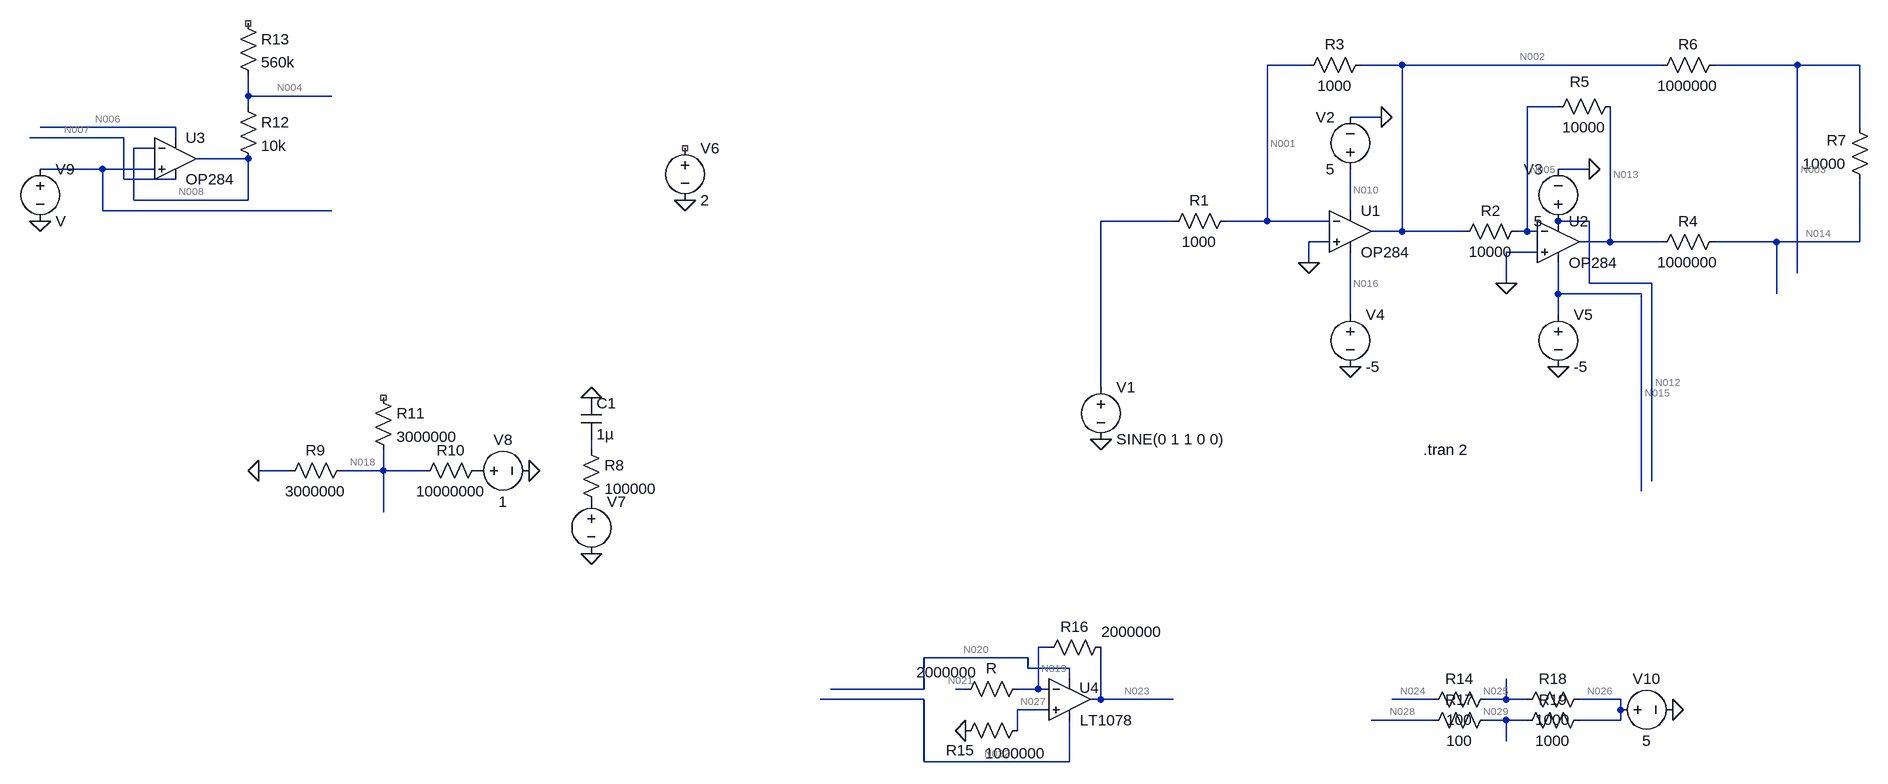
[diagram p0: schematic Sim_negADCinversion_9_18_20.asc]
Sim_negADCinversion_9_18_20.asc, the LTspice schematic file:
Version 4
SHEET 1 2288 884
WIRE 432 -192 368 -192
WIRE 576 -192 512 -192
WIRE 976 -192 576 -192
WIRE 1184 -192 1056 -192
WIRE 1280 -192 1184 -192
WIRE -1200 -144 -1200 -176
WIRE -1072 -144 -1200 -144
WIRE -1200 -128 -1200 -144
WIRE 816 -128 768 -128
WIRE 544 -112 496 -112
WIRE -1312 -96 -1520 -96
WIRE 1280 -96 1280 -192
WIRE -1392 -80 -1536 -80
WIRE -1312 -80 -1312 -96
WIRE -1344 -64 -1376 -64
WIRE -1200 -48 -1280 -48
WIRE -1424 -32 -1520 -32
WIRE -1344 -32 -1424 -32
WIRE 864 -32 816 -32
WIRE -1392 -16 -1392 -80
WIRE -1312 -16 -1392 -16
WIRE -1376 16 -1376 -64
WIRE -1200 16 -1200 -48
WIRE -1200 16 -1376 16
WIRE -1424 32 -1424 -32
WIRE -1072 32 -1424 32
WIRE 496 32 496 -32
WIRE 224 48 112 48
WIRE 368 48 368 -192
WIRE 368 48 304 48
WIRE 464 48 368 48
WIRE 864 48 816 48
WIRE 576 64 576 -192
WIRE 576 64 528 64
WIRE 672 64 576 64
WIRE 768 64 768 -128
WIRE 768 64 752 64
WIRE 784 64 768 64
WIRE 464 80 432 80
WIRE 896 80 896 -128
WIRE 896 80 848 80
WIRE 976 80 896 80
WIRE 1152 80 1056 80
WIRE 1280 80 1280 -16
WIRE 1280 80 1152 80
WIRE 784 96 736 96
WIRE 432 112 432 80
WIRE 1184 128 1184 -192
WIRE 736 144 736 96
WIRE 864 144 864 48
WIRE 960 144 864 144
WIRE 816 160 816 112
WIRE 944 160 816 160
WIRE 1152 160 1152 80
WIRE 496 192 496 96
WIRE 816 192 816 160
WIRE 112 304 112 48
WIRE -672 400 -672 384
WIRE -1136 432 -1184 432
WIRE -992 432 -992 400
WIRE -992 432 -1056 432
WIRE -928 432 -992 432
WIRE 960 448 960 144
WIRE 944 464 944 160
WIRE -992 496 -992 432
WIRE 32 704 16 704
WIRE 0 720 -160 720
WIRE 0 736 0 720
WIRE 64 736 0 736
WIRE 64 752 64 736
WIRE -160 768 -160 720
WIRE -160 768 -304 768
WIRE -96 768 -112 768
WIRE 16 768 16 704
WIRE 16 768 -16 768
WIRE 32 768 16 768
WIRE -160 784 -320 784
WIRE 112 784 112 704
WIRE 112 784 96 784
WIRE 224 784 112 784
WIRE 624 784 560 784
WIRE 736 784 736 752
WIRE 736 784 704 784
WIRE 768 784 736 784
WIRE 912 784 848 784
WIRE 32 800 -16 800
WIRE 912 800 912 784
WIRE 624 816 528 816
WIRE 736 816 704 816
WIRE 768 816 736 816
WIRE 912 816 912 800
WIRE 912 816 848 816
WIRE -16 832 -16 800
WIRE 736 848 736 816
WIRE -160 880 -160 784
WIRE 64 880 64 816
WIRE 64 880 -160 880
FLAG 432 112 0
FLAG 736 144 0
FLAG 112 384 0
FLAG 496 272 0
FLAG 816 272 0
FLAG 864 -32 0
FLAG 544 -112 0
FLAG -528 16 0
FLAG -672 560 0
FLAG -672 320 0
FLAG -768 432 0
FLAG -1184 432 0
FLAG -1520 48 0
FLAG -96 832 0
FLAG 992 800 0
SYMBOL voltage 112 288 R0
WINDOW 123 0 0 Left 0
WINDOW 39 0 0 Left 0
SYMATTR InstName V1
SYMATTR Value SINE(0 1 1 0 0)
SYMBOL res 320 32 R90
WINDOW 0 0 56 VBottom 2
WINDOW 3 32 56 VTop 2
SYMATTR InstName R1
SYMATTR Value 1000
SYMBOL Opamps\\OP284 496 0 R0
SYMATTR InstName U1
SYMBOL Opamps\\OP284 816 16 R0
SYMATTR InstName U2
SYMBOL res 768 48 R90
WINDOW 0 0 56 VBottom 2
WINDOW 3 32 56 VTop 2
SYMATTR InstName R2
SYMATTR Value 10000
SYMBOL res 528 -208 R90
WINDOW 0 0 56 VBottom 2
WINDOW 3 32 56 VTop 2
SYMATTR InstName R3
SYMATTR Value 1000
SYMBOL res 912 -144 R90
WINDOW 0 -7 63 VBottom 2
WINDOW 3 32 56 VTop 2
SYMATTR InstName R5
SYMATTR Value 10000
SYMBOL voltage 496 -16 R180
WINDOW 0 24 96 Left 2
WINDOW 3 24 16 Left 2
WINDOW 123 0 0 Left 0
WINDOW 39 0 0 Left 0
SYMATTR InstName V2
SYMATTR Value 5
SYMBOL voltage 816 64 R180
WINDOW 0 24 96 Left 2
WINDOW 3 24 16 Left 2
WINDOW 123 0 0 Left 0
WINDOW 39 0 0 Left 0
SYMATTR InstName V3
SYMATTR Value 5
SYMBOL res 1072 -208 R90
WINDOW 0 0 56 VBottom 2
WINDOW 3 32 56 VTop 2
SYMATTR InstName R6
SYMATTR Value 1000000
SYMBOL res 1296 0 R180
WINDOW 0 36 76 Left 2
WINDOW 3 36 40 Left 2
SYMATTR InstName R7
SYMATTR Value 10000
SYMBOL res 1072 64 R90
WINDOW 0 0 56 VBottom 2
WINDOW 3 32 56 VTop 2
SYMATTR InstName R4
SYMATTR Value 1000000
SYMBOL voltage 496 176 R0
WINDOW 123 0 0 Left 0
WINDOW 39 0 0 Left 0
SYMATTR InstName V4
SYMATTR Value -5
SYMBOL voltage 816 176 R0
WINDOW 123 0 0 Left 0
WINDOW 39 0 0 Left 0
SYMATTR InstName V5
SYMATTR Value -5
SYMBOL voltage -528 -80 R0
WINDOW 123 0 0 Left 0
WINDOW 39 0 0 Left 0
SYMATTR InstName V6
SYMATTR Value 2
SYMBOL voltage -672 464 R0
WINDOW 123 0 0 Left 0
WINDOW 39 0 0 Left 0
SYMATTR InstName V7
SYMATTR Value ""
SYMBOL res -688 384 R0
SYMATTR InstName R8
SYMATTR Value 100000
SYMBOL cap -688 320 R0
SYMATTR InstName C1
SYMATTR Value 1µ
SYMBOL res -1040 416 R90
WINDOW 0 0 56 VBottom 2
WINDOW 3 32 56 VTop 2
SYMATTR InstName R9
SYMATTR Value 3000000
SYMBOL res -832 416 R90
WINDOW 0 0 56 VBottom 2
WINDOW 3 32 56 VTop 2
SYMATTR InstName R10
SYMATTR Value 10000000
SYMBOL voltage -864 432 R270
WINDOW 0 32 56 VTop 2
WINDOW 3 -32 56 VBottom 2
WINDOW 123 0 0 Left 0
WINDOW 39 0 0 Left 0
SYMATTR InstName V8
SYMATTR Value 1
SYMBOL res -1008 304 R0
SYMATTR InstName R11
SYMATTR Value 3000000
SYMBOL voltage -1520 -48 R0
SYMATTR InstName V9
SYMBOL Opamps\\OP284 -1312 -112 R0
SYMATTR InstName U3
SYMBOL res -1216 -144 R0
SYMATTR InstName R12
SYMATTR Value 10k
SYMBOL res -1216 -272 R0
SYMATTR InstName R13
SYMATTR Value 560k
SYMBOL Opamps\\LT1078 64 720 R0
WINDOW 0 15 46 Left 2
SYMATTR InstName U4
SYMBOL res 0 752 R90
WINDOW 0 0 56 VBottom 2
WINDOW 3 -25 124 VTop 2
SYMATTR InstName R
SYMATTR Value 2000000
SYMBOL res 0 816 R90
WINDOW 0 62 104 VBottom 2
WINDOW 3 35 19 VTop 2
SYMATTR InstName R15
SYMATTR Value 1000000
SYMBOL res 128 688 R90
WINDOW 0 0 56 VBottom 2
WINDOW 3 -24 -32 VTop 2
SYMATTR InstName R16
SYMATTR Value 2000000
SYMBOL res 720 768 R90
WINDOW 0 0 56 VBottom 2
WINDOW 3 32 56 VTop 2
SYMATTR InstName R14
SYMATTR Value 100
SYMBOL res 720 800 R90
WINDOW 0 0 56 VBottom 2
WINDOW 3 32 56 VTop 2
SYMATTR InstName R17
SYMATTR Value 100
SYMBOL res 864 768 R90
WINDOW 0 0 56 VBottom 2
WINDOW 3 32 56 VTop 2
SYMATTR InstName R18
SYMATTR Value 1000
SYMBOL res 864 800 R90
WINDOW 0 0 56 VBottom 2
WINDOW 3 32 56 VTop 2
SYMATTR InstName R19
SYMATTR Value 1000
SYMBOL voltage 896 800 R270
WINDOW 0 32 56 VTop 2
WINDOW 3 -32 56 VBottom 2
WINDOW 123 0 0 Left 0
WINDOW 39 0 0 Left 0
SYMATTR InstName V10
SYMATTR Value 5
TEXT 608 400 Left 2 !.tran 2

The netlist it stands for:
* Sim_negADCinversion_9_18_20.asc
V1 N011 0 SINE(0 1 1 0 0)
R1 N001 N011 1000
XU1 0 N001 N010 N016 N002 OP284  ; pins In+ In- V+ V- OUT
XU2 0 N005 N012 N015 N013 OP284  ; pins In+ In- V+ V- OUT
R2 N005 N002 10000
R3 N002 N001 1000
R5 N013 N005 10000
V2 N010 0 5
V3 N012 0 5
R6 N003 N002 1000000
R7 N014 N003 10000
R4 N014 N013 1000000
V4 N016 0 -5
V5 N015 0 -5
V6 NC_01 0 2
V7 P001 0
R8 N017 P001 100000
C1 0 N017 1µ
R9 N018 0 3000000
R10 P002 N018 10000000
V8 P002 0 1
R11 NC_02 N018 3000000
V9 N009 0 V
XU3 N009 N008 N006 N007 N008 OP284  ; pins In+ In- V+ V- OUT
R12 N004 N008 10k
R13 NC_03 N004 560k
XU4 N027 N019 N020 N022 N023 LT1078  ; pins In+ In- V+ V- OUT
R N019 N021 2000000
R15 N027 0 1000000
R16 N023 N019 2000000
R14 N025 N024 100
R17 N029 N028 100
R18 N026 N025 1000
R19 N026 N029 1000
V10 N026 0 5
.tran 2
.lib ADI1.lib
.backanno
.end

* Results of the author's LTspice run, read from the files saved beside the schematic
* Operating Point, zero values left out:
*   V(n001) = 21.9 µV
*   V(n010) = 5 V
*   V(n016) = -5 V
*   V(n002) = -13.43 µV
*   V(n005) = 21.9 µV
*   V(n012) = 5 V
*   V(n015) = -5 V
*   V(n013) = -515.2 µV
*   V(n003) = -263.1 µV
*   V(n014) = -265.5 µV
*   V(n018) = 230.8 mV
*   V(p002) = 1 V
*   V(n008) = -65.28 µV
*   V(n006) = -628.8 mV
*   V(n007) = 628.7 mV
*   V(n004) = -65.28 µV
*   V(n019) = 18.28 V
*   V(n027) = 28.85 mV
*   V(n020) = 18.84 V
*   V(n023) = 18.33 V
*   V(n022) = 18.33 V
*   V(n021) = 18.28 V
*   V(n025) = 5 V
*   V(n024) = 5 V
*   V(n029) = 5 V
*   V(n028) = 5 V
*   V(n026) = 5 V
*   I(R16) = 21.27 nA
*   I(R15) = 28.85 nA
*   I(R10) = 76.92 nA
*   I(R9) = 76.92 nA
*   I(R4) = 249.6 pA
*   I(R7) = -249.6 pA
*   I(R6) = -249.6 pA
*   I(R5) = -53.71 nA
*   I(R3) = -35.34 nA
*   I(R2) = 3.534 nA
*   I(R1) = 21.9 nA
*   I(V8) = -76.92 nA
*   I(V5) = 1.009 mA
*   I(V4) = 1.009 mA
*   I(V3) = -1.009 mA
*   I(V2) = -1.009 mA
*   I(V1) = 21.9 nA
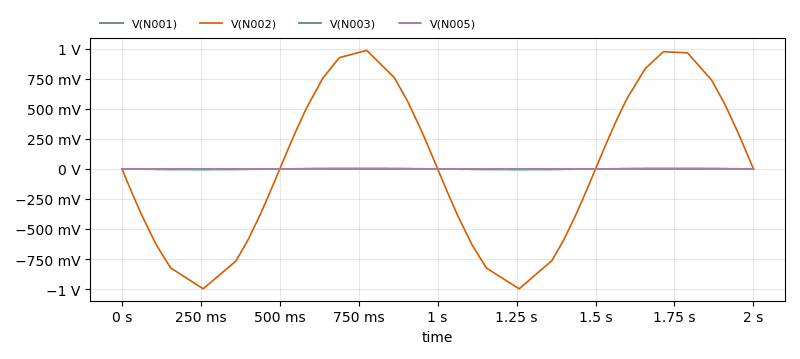
[diagram p1: Transient Analysis of Sim_negADCinversion_9_18_20.asc, plotted from the saved traces]
* Transient Analysis, 1 run:
*   V(N001): min 19.94 µV, max 56.07 µV, average 30.26 µV, rms 33.02 µV, last 21.98 µV
*   V(N002): min -997.8 mV, max 986.8 mV, average 2.921 mV, rms 695.6 mV, last -13.28 µV
*   V(N003): min -5.228 mV, max 4.647 mV, average -248.4 µV, rms 3.47 mV, last -263.1 µV
*   V(N005): min 21.54 µV, max 22.37 µV, average 21.93 µV, rms 21.93 µV, last 21.84 µV